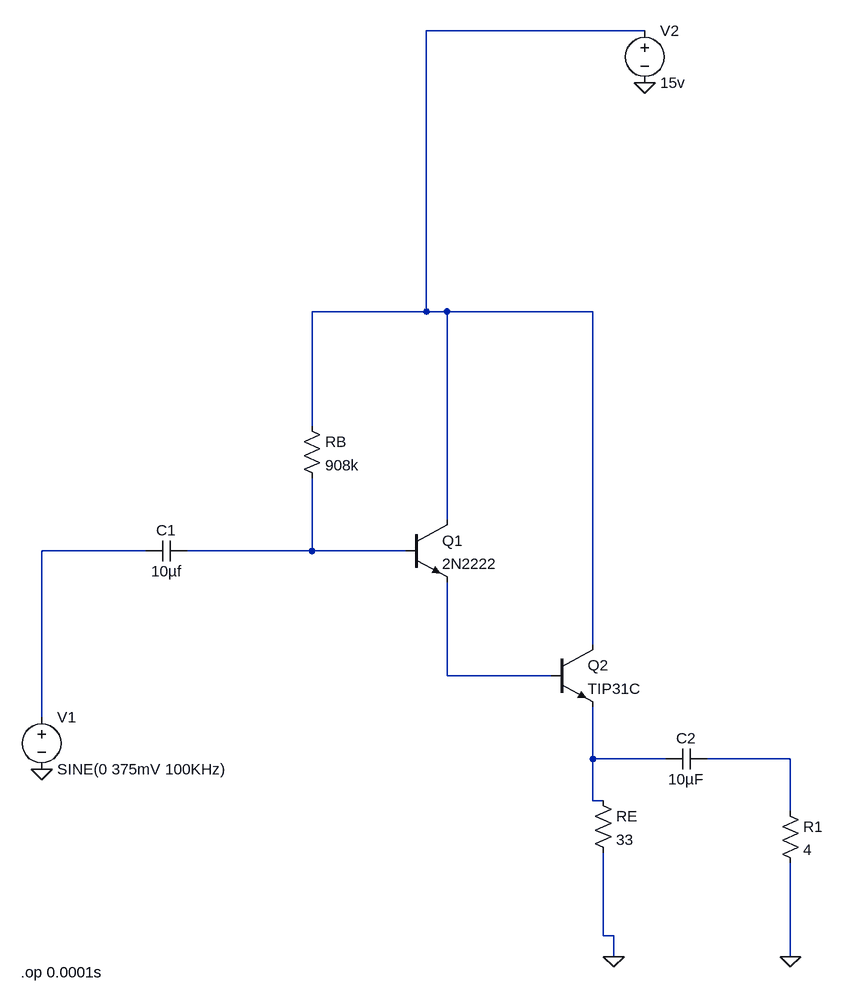
[diagram p0: schematic Draft9.asc]
Draft9.asc, the LTspice schematic file:
Version 4
SHEET 1 904 952
WIRE 624 -512 288 -512
WIRE 288 -80 288 -512
WIRE 288 -80 112 -80
WIRE 320 -80 288 -80
WIRE 544 -80 320 -80
WIRE 112 96 112 -80
WIRE 320 240 320 -80
WIRE -144 288 -304 288
WIRE 112 288 112 176
WIRE 112 288 -80 288
WIRE 256 288 112 288
WIRE 544 432 544 -80
WIRE 320 480 320 336
WIRE 480 480 320 480
WIRE -304 544 -304 288
WIRE 544 608 544 528
WIRE 656 608 544 608
WIRE 848 608 720 608
WIRE 544 672 544 608
WIRE 560 672 544 672
WIRE 848 688 848 608
WIRE 560 880 560 752
WIRE 576 880 560 880
WIRE 576 912 576 880
WIRE 848 912 848 768
FLAG 624 -432 0
FLAG -304 624 0
FLAG 576 912 0
FLAG 848 912 0
SYMBOL res 96 80 R0
SYMATTR InstName RB
SYMATTR Value 908k
SYMBOL npn 256 240 R0
SYMATTR InstName Q1
SYMATTR Value 2N2222
SYMBOL npn 480 432 R0
SYMATTR InstName Q2
SYMATTR Value TIP31C
SYMBOL voltage -304 528 R0
WINDOW 123 0 0 Left 0
WINDOW 39 0 0 Left 0
SYMATTR InstName V1
SYMATTR Value SINE(0 375mV 100KHz)
SYMBOL voltage 624 -528 R0
WINDOW 123 0 0 Left 0
WINDOW 39 0 0 Left 0
SYMATTR InstName V2
SYMATTR Value 15v
SYMBOL res 544 656 R0
SYMATTR InstName RE
SYMATTR Value 33
SYMBOL cap -80 272 R90
WINDOW 0 0 32 VBottom 2
WINDOW 3 32 32 VTop 2
SYMATTR InstName C1
SYMATTR Value 10µf
SYMBOL cap 720 592 R90
WINDOW 0 0 32 VBottom 2
WINDOW 3 32 32 VTop 2
SYMATTR InstName C2
SYMATTR Value 10µF
SYMBOL res 832 672 R0
SYMATTR InstName R1
SYMATTR Value 4
TEXT -336 936 Left 2 !.op 0.0001s

The netlist it stands for:
* Draft9.asc
RB N001 N003 908k
Q1 N001 N003 N004 0 2N2222
Q2 N001 N004 N005 0 TIP31C
V1 N002 0 SINE(0 375mV 100KHz)
V2 N001 0 15v
RE N005 0 33
C1 N003 N002 10µf
C2 N006 N005 10µF
R1 N006 0 4
.model NPN NPN
.model PNP PNP
.lib standard.bjt
.op 0.0001s
.backanno
.end